# Altium schematic sheet main.SchDoc: =DocumentName
size A4; CompanyName: "AS Manufacturing" LLC; Organization: "AS Manufacturing" LLC; Address1: 5 Sklyarenka St.; Address2: Kyiv 04073; Address3: Ukraine; Address4: https://ajax.systems/en/; SheetNumber: 1; SheetTotal: 7; Template_version: 1.0.1
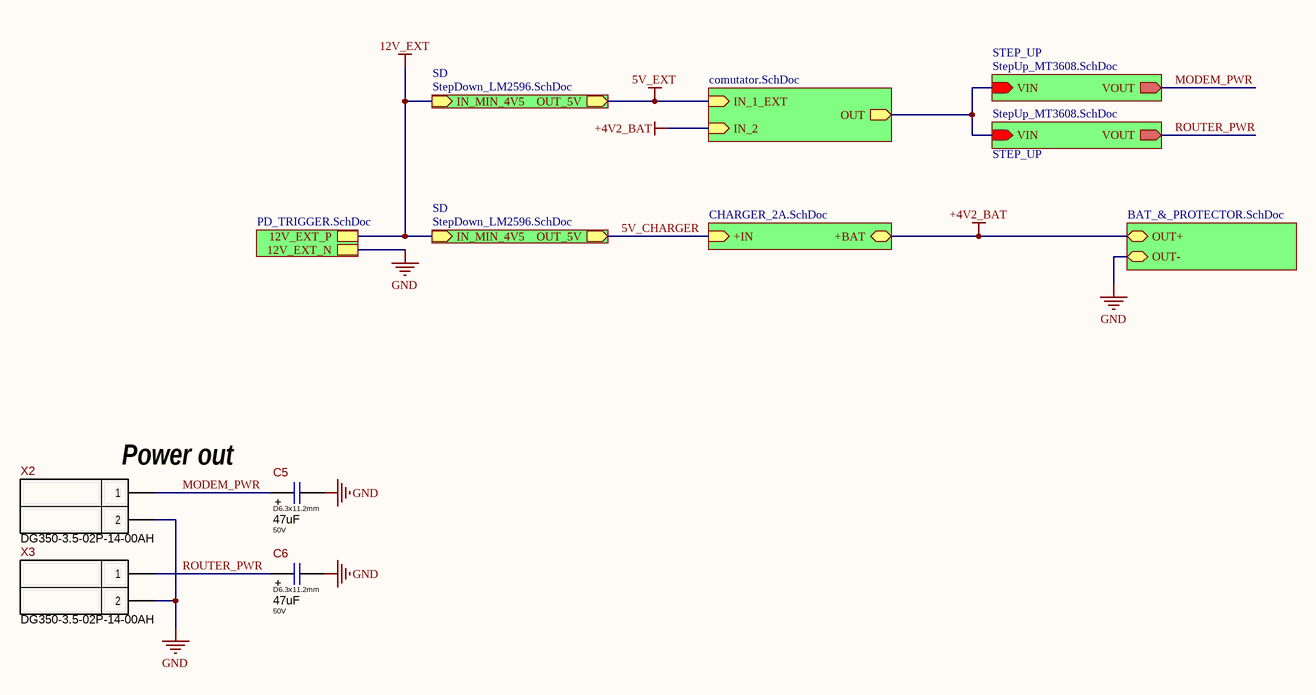
[diagram p0: main.SchDoc]

## Parts
C5  value 47uF  Package: D6.3x11.2mm  Voltage: 50V  [CAP-AE-PTH-63D05x112H15]  (hidden comment: 47uFx50V)
C6  value 47uF  Package: D6.3x11.2mm  Voltage: 50V  [CAP-AE-PTH-63D05x112H15]  (hidden comment: 47uFx50V)
X2  DG350-3.5-02P  [DG350-3.5-02P-14-00AH]  (value not drawn)
X3  DG350-3.5-02P  [DG350-3.5-02P-14-00AH]  (value not drawn)

## Sub-sheets
charger = CHARGER_2A.SchDoc: +BAT (bidir), +IN (in)
COMUTATOR = comutator.SchDoc: IN_1_EXT (in), IN_2 (in), OUT (out)
Designator = PD_TRIGGER.SchDoc: 12V_EXT_P, 12V_EXT_N
pROTECTOR = BAT_&_PROTECTOR.SchDoc: OUT+ (bidir), OUT- (bidir)
SD = StepDown_LM2596.SchDoc: IN_MIN_4V5 (in), OUT_5V (out)
SD = StepDown_LM2596.SchDoc: IN_MIN_4V5 (in), OUT_5V (out)
STEP_UP = StepUp_MT3608.SchDoc: VIN (in), VOUT (out)
STEP_UP = StepUp_MT3608.SchDoc: VIN (in), VOUT (out)

## Nets
5V_EXT: sheet COMUTATOR/IN_1_EXT, sheet SD/OUT_5V
12V_EXT: sheet Designator/12V_EXT_P, sheet SD/IN_MIN_4V5, sheet SD/IN_MIN_4V5
+4V2_BAT: sheet charger/+BAT, sheet COMUTATOR/IN_2, sheet pROTECTOR/OUT+
GND: C5.2 C6.2 X2.2 X3.2 ; sheet pROTECTOR/OUT-, sheet Designator/12V_EXT_N
5V_CHARGER: sheet charger/+IN, sheet SD/OUT_5V
MODEM_PWR: C5.1 X2.1 ; sheet STEP_UP/VOUT
ROUTER_PWR: C6.1 X3.1 ; sheet STEP_UP/VOUT
(unnamed): sheet STEP_UP/VIN, sheet COMUTATOR/OUT, sheet STEP_UP/VIN

## Notes on the sheet
- (near X2) Power out
- Title
- Product:
- Project:
- Size:
- Date:
- Variant:
- A4
- Authors:
- Time:
- Sheet
- of
- Revision:
- Commit:
- (in symbol EEU-FR1H470) +

## Library data of the parts
C5 C6 = EEU-FR1H470: 47uF 50V ±20% D6.3x11.2mm Low ESR Aluminum Electrolytic Capacitor, Ripple Current 405mA, 5000 Hrs @ 105°C; Manufacturer: Panasonic; Ajax_1C_ID: 70256; Ajax_1C_PN: 47uF 50V 20% D6.3x11.2mm Industry EEU-FR1J470H Aluminum Capacitor Low ESR RoHS; Ajax_1С_Status: RND Only; Standard Lead Time: 29 Weeks; Component Status: Released; Dielectric Type: NONE; GUID_1C: aba6b453-f331-11ed-a36c-005056994834; Part Number: EEU-FR1H470; Part Type: Aluminum; Component Type: PTH; Temperature Range: -40°C ~ 105°C; Tolerance: ±20%; ComponentLink1URL: https://industrial.panasonic.com/cdbs/www-data/pdf/RDF0000/ABA0000C1259.pdf; Supplier 1: Mouser; Supplier Part Number 1: 667-EEU-FR1H470; Replacement: NONE; Price: 0; ComponentLink1Description: Datasheet
X2 X3 = DG350-3.5-02P-14-00AH: Screw Terminal, 3.5mm Pitch, 2 pin, Green; Manufacturer: Degson; Ajax_1C_ID: 21524; Ajax_1C_PN: DG350-3.5-02P-14-00AH, клеммник; Ajax_1С_Status: RND Only; Component Status: Released; Replacement: NONE; GUID_1C: 367ff815-d639-11ea-ab63-0050569f2651; Part Number: DG350-3.5-02P-14-00AH; Part Type: Terminal; Component Type: PTH; Temperature Range: -40°C ~ 105°C; ComponentLink1URL: \\altiumdb.ajax.local\files\Datasheet\Connectors\DG350-3.5,3.96.pdf; Price: 0,17091154; ComponentLink1Description: Datasheet